# Altium schematic sheet WaterSystem1.SchDoc
size A
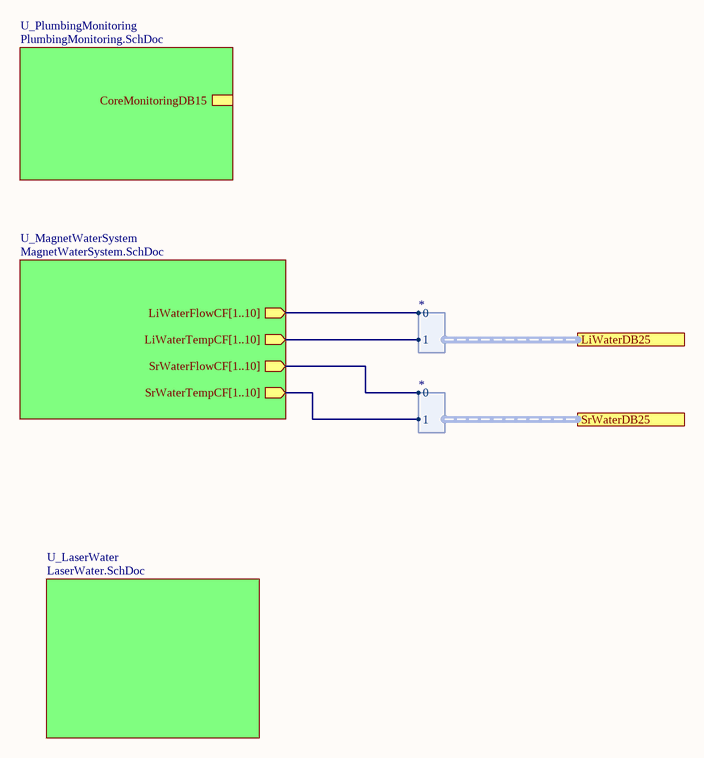
[diagram p0: WaterSystem1.SchDoc]

## Sub-sheets
U_LaserWater = LaserWater.SchDoc: no entries
U_MagnetWaterSystem = MagnetWaterSystem.SchDoc: LiWaterFlowCF[1..10] (out, harness *), LiWaterTempCF[1..10] (out), SrWaterFlowCF[1..10] (out), SrWaterTempCF[1..10] (out)
U_PlumbingMonitoring = PlumbingMonitoring.SchDoc: CoreMonitoringDB15 (harness *)

## Ports
LiWaterDB25 (harness *), SrWaterDB25 (harness *)

## Harnesses
*: 0, 1